# Altium schematic sheet Schematic.schdoc
size 209 x 146 mm
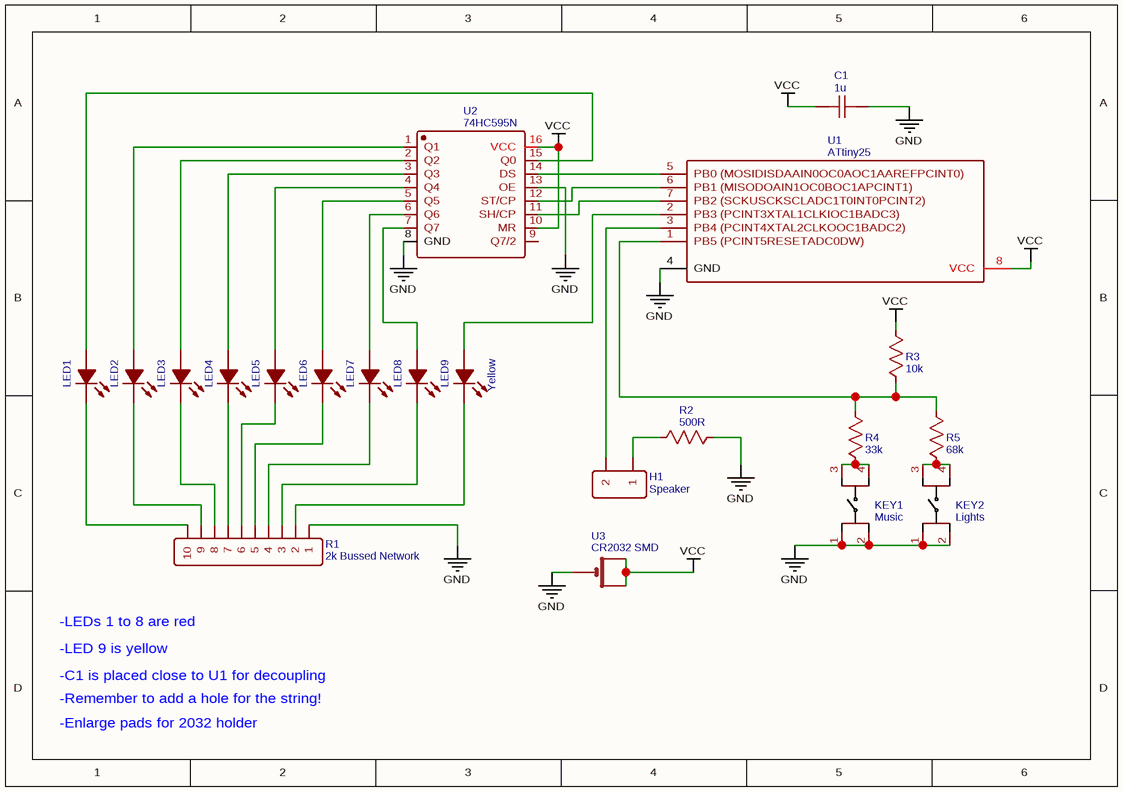
[diagram p0: Schematic.schdoc]

## Parts
C1  1u  [RAD-0.1]
H1  Speaker  [HDR-2X1/2.54]
KEY1  Music  [KEY-6.0*6.0-2]
KEY2  Lights  [KEY-6.0*6.0-2]
LED1  204-10SURD/S530-A3  [LED-3MM/2.54]  (value not drawn)
LED2  204-10SURD/S530-A3  [LED-3MM/2.54]  (value not drawn)
LED3  204-10SURD/S530-A3  [LED-3MM/2.54]  (value not drawn)
LED4  204-10SURD/S530-A3  [LED-3MM/2.54]  (value not drawn)
LED5  204-10SURD/S530-A3  [LED-3MM/2.54]  (value not drawn)
LED6  204-10SURD/S530-A3  [LED-3MM/2.54]  (value not drawn)
LED7  204-10SURD/S530-A3  [LED-3MM/2.54]  (value not drawn)
LED8  204-10SURD/S530-A3  [LED-3MM/2.54]  (value not drawn)
LED9  Yellow  [LED-3MM/2.54]
R1  2k Bussed Network  [HDR-TH_10PIN-V-FEMALE-PITCH2.54]
R2  500R  [AXIAL-0.4]
R3  10k  [AXIAL-0.4]
R4  33k  [AXIAL-0.4]
R5  68k  [AXIAL-0.4]
U1  ATtiny25  [DIP8]
U2  74HC595N  [DIP16]
U3  CR2032 SMD  [CR2032 SMD HOLDER]

## Nets
GND: C1.1 KEY1.1 KEY1.2 KEY2.1 KEY2.2 R1.1 R2.2 U1.4(GND) U2.8(GND) U2.13(OE) U3.-
VCC: C1.2 R3.2 U1.8(VCC) U2.10(MR) U2.16(VCC) U3.+1(+) U3.+2(+1)
NetH1_1: H1.1 R2.1
NetH1_2: H1.2 U1.3(PB4_(PCINT4XTAL2CLKOOC1BADC2))
NetKEY1_3: KEY1.3 KEY1.4 R4.1
NetKEY2_3: KEY2.3 KEY2.4 R5.1
NetLED1_1: LED1.1(A) U2.15(Q0)
NetLED1_2: LED1.2(K) R1.10
NetLED2_1: LED2.1(A) U2.1(Q1)
NetLED2_2: LED2.2(K) R1.9
NetLED3_1: LED3.1(A) U2.2(Q2)
NetLED3_2: LED3.2(K) R1.8
NetLED4_1: LED4.1(A) U2.3(Q3)
NetLED4_2: LED4.2(K) R1.7
NetLED5_1: LED5.1(A) U2.4(Q4)
NetLED5_2: LED5.2(K) R1.6
NetLED6_1: LED6.1(A) U2.5(Q5)
NetLED6_2: LED6.2(K) R1.5
NetLED7_1: LED7.1(A) U2.6(Q6)
NetLED7_2: LED7.2(K) R1.4
NetLED8_1: LED8.1(A) U2.7(Q7)
NetLED8_2: LED8.2(K) R1.3
NetLED9_1: LED9.1(A) U1.2(PB3_(PCINT3XTAL1CLKIOC1BADC3))
NetLED9_2: LED9.2(K) R1.2
NetR3_1: R3.1 R4.2 R5.2 U1.1(PB5_(PCINT5RESETADC0DW))
NetU1_5: U1.5(PB0_(MOSIDISDAAIN0OC0AOC1AAREFPCINT0)) U2.14(DS)
NetU1_6: U1.6(PB1_(MISODOAIN1OC0BOC1APCINT1)) U2.12(ST/CP)
NetU1_7: U1.7(PB2_(SCKUSCKSCLADC1T0INT0PCINT2)) U2.11(SH/CP)

Not connected (* = marked no-connect by the designer): U2 9(Q7/2)

## Notes on the sheet
- -LEDs 1 to 8 are red
- -LED 9 is yellow
- -C1 is placed close to U1 for decoupling
- -Remember to add a hole for the string!
- -Enlarge pads for 2032 holder

## Library data of the parts
C1 = 1u: nameAlias: Value(F); spicePre: C; spiceSymbolName: Cap_RAD-0.1_US
H1 = Speaker: BOM_Manufacturer: TE Connectivity; BOM_Manufacturer Part: 826629-2; BOM_Supplier: LCSC; image: //image.lceda.cn/szlcsc/C86471.jpg; BOM_Supplier Part: C86471; spicePre: H
KEY1 = Music: BOM_Manufacturer: SOFNG; BOM_Manufacturer Part: TS-1102-5016; Contributor: EasyEDA; BOM_Supplier: LCSC; BOM_Supplier Part: C111609; spicePre: K
KEY2 = Lights: BOM_Manufacturer: SOFNG; BOM_Manufacturer Part: TS-1102-5016; Contributor: EasyEDA; BOM_Supplier: LCSC; BOM_Supplier Part: C111609; spicePre: K
LED1-LED8 = 204-10SURD/S530-A3: BOM_Manufacturer: EVERLIGHT; BOM_Supplier: LCSC; BOM_Manufacturer Part: 204-10SURD/S530-A3; BOM_Supplier Part: C99772; spicePre: L
LED9 = Yellow: BOM_Manufacturer: EVERLIGHT; BOM_Manufacturer Part: 204-10SURD/S530-A3; BOM_Supplier: LCSC; BOM_Supplier Part: C99772; spicePre: L
R1 = 2k Bussed Network: BOM_Manufacturer: BOOMELE; BOM_Manufacturer Part: 2.54mm 1*10P Straight Female header Gold-plated; BOM_Supplier: LCSC; BOM_Supplier Part: C35445; spicePre: J
R2 = 500R: nameAlias: Value(Ω); spicePre: R; spiceSymbolName: Res_0805(1/8W)_US
R3 = 10k: nameAlias: Value(Ω); spicePre: R; spiceSymbolName: Res_0805(1/8W)_US
R4 = 33k: nameAlias: Value(Ω); spicePre: R; spiceSymbolName: Res_0805(1/8W)_US
R5 = 68k: nameAlias: Value(Ω); spicePre: R; spiceSymbolName: Res_0805(1/8W)_US
U1 = ATtiny25: description: 8-bit AVR Microcontroller, 10MHz, 1.8-5.5V, 8K Flash, 512 Bytes EEPROM, 512 Bytes SRAM, Industrial Grade (-40u7648 to 85u7648), 8-Lead PDIP, Pb-Free; spicePre: U
U3 = CR2032 SMD: Contributor: Adafruit; spicePre: U
U2 = 74HC595N: spicePre: X